# Altium schematic sheet Button.SchDoc
size A4
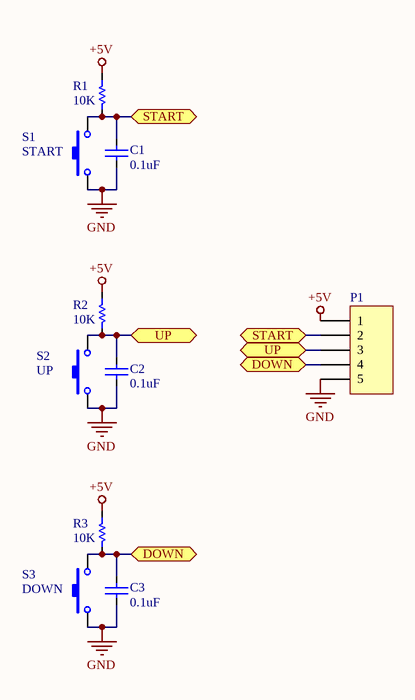
[diagram p0: Button.SchDoc]

## Parts
C1  0.1uF  [C0805]
C2  0.1uF  [C0805]
C3  0.1uF  [C0805]
P1  Header 5  [HDR1X5]  (value not drawn)
R1  10K  [R0805]
R2  10K  [R0805]
R3  10K  [R0805]
S1  START  [SWITCH-TACTILE-6mm]
S2  UP  [SWITCH-TACTILE-6mm]
S3  DOWN  [SWITCH-TACTILE-6mm]

## Ports
DOWN (bidir), START (bidir), UP (bidir)

## Nets
+5V: P1.1 R1.1 R2.1 R3.1
GND: C1.2 C2.2 C3.2 P1.5 S1.2 S2.2 S3.2
DOWN: C3.1 P1.4 R3.2 S3.1 ; port DOWN
START: C1.1 P1.2 R1.2 S1.1 ; port START
UP: C2.1 P1.3 R2.2 S2.1 ; port UP

## Library data of the parts
C1-C3 = Cap: CAP CER 0.1UF 50V 10% X7R 0805; Manufacturer: Kemet; Manufacturer Part Number: C0805C104K5RACTU; Digi-Key Part Number: 399-1170-1-ND; Link: http://www.digikey.com/product-detail/en/C0805C104K5RACTU/399-1170-1-ND/411445
P1 = Header 5: Header, 5-Pin
R1-R3 = Res1: RES 10K OHM 1/8W 1% 0805 SMD; Manufacturer Part Number: ERJ-6ENF1002V; Manufacturer: Panasonic Electronic Components; Digi-Key Part Number: P10.0KCCT-ND; Link: http://www.digikey.com/product-detail/en/ERJ-6ENF1002V/P10.0KCCT-ND/119248
S1-S3 = SW-PB: SWITCH TACTILE SPST-NO 0.05A 12V; Manufacturer Part Number: FSM101; Manufacturer: TE Connectivity; Digi-Key Part Number: 450-1157-ND; Link: http://www.te.com/commerce/DocumentDelivery/DDEController?Action=srchrtrv&DocNm=1571140&DocType=Customer+Drawing&DocLang=English